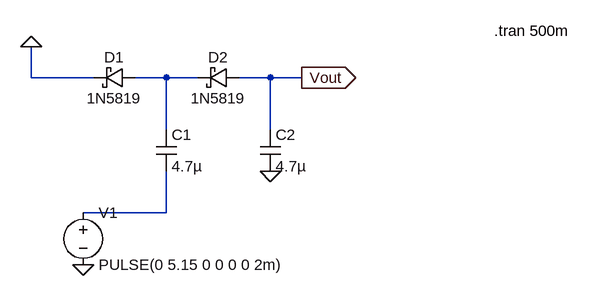
[diagram p0: schematic Charge Pump [VERSION 1].asc]
Charge Pump [VERSION 1].asc, the LTspice schematic file:
Version 4
SHEET 1 880 680
WIRE -16 192 -16 144
WIRE 80 192 -16 192
WIRE 192 192 144 192
WIRE 240 192 192 192
WIRE 352 192 304 192
WIRE 400 192 352 192
WIRE 192 272 192 192
WIRE 352 272 352 192
WIRE 192 400 192 336
WIRE 192 400 64 400
FLAG -16 144 0
FLAG 352 336 0
FLAG 400 192 Vout
IOPIN 400 192 Out
FLAG 64 480 0
SYMBOL schottky 144 176 R90
WINDOW 0 0 32 VBottom 2
WINDOW 3 32 32 VTop 2
SYMATTR InstName D1
SYMATTR Value 1N5819
SYMATTR Description Diode
SYMATTR Type diode
SYMBOL schottky 304 176 R90
WINDOW 0 0 32 VBottom 2
WINDOW 3 32 32 VTop 2
SYMATTR InstName D2
SYMATTR Value 1N5819
SYMATTR Description Diode
SYMATTR Type diode
SYMBOL cap 176 272 R0
SYMATTR InstName C1
SYMATTR Value 4.7µ
SYMBOL cap 336 272 R0
SYMATTR InstName C2
SYMATTR Value 4.7µ
SYMBOL voltage 64 384 R0
WINDOW 123 0 0 Left 0
WINDOW 39 0 0 Left 0
SYMATTR InstName V1
SYMATTR Value PULSE(0 5.15 0 0 0 0 2m)
TEXT 696 120 Left 2 !.tran 500m

The netlist it stands for:
* Charge Pump [VERSION 1].asc
D1 N001 0 1N5819
D2 Vout N001 1N5819
C1 N001 N002 4.7µ
C2 Vout 0 4.7µ
V1 N002 0 PULSE(0 5.15 0 0 0 0 2m)
.model D D
.lib standard.dio
.tran 500m
.backanno
.end